# EasyEDA schematic RPi Shield - Schematic.json
TITLE: RPi Motor & Power Shield; REV: 1.0; Date: 2019-11-08; Sheet: 1/1; Drawn By: Liam Smolenaars; Company: McMaster IEEE
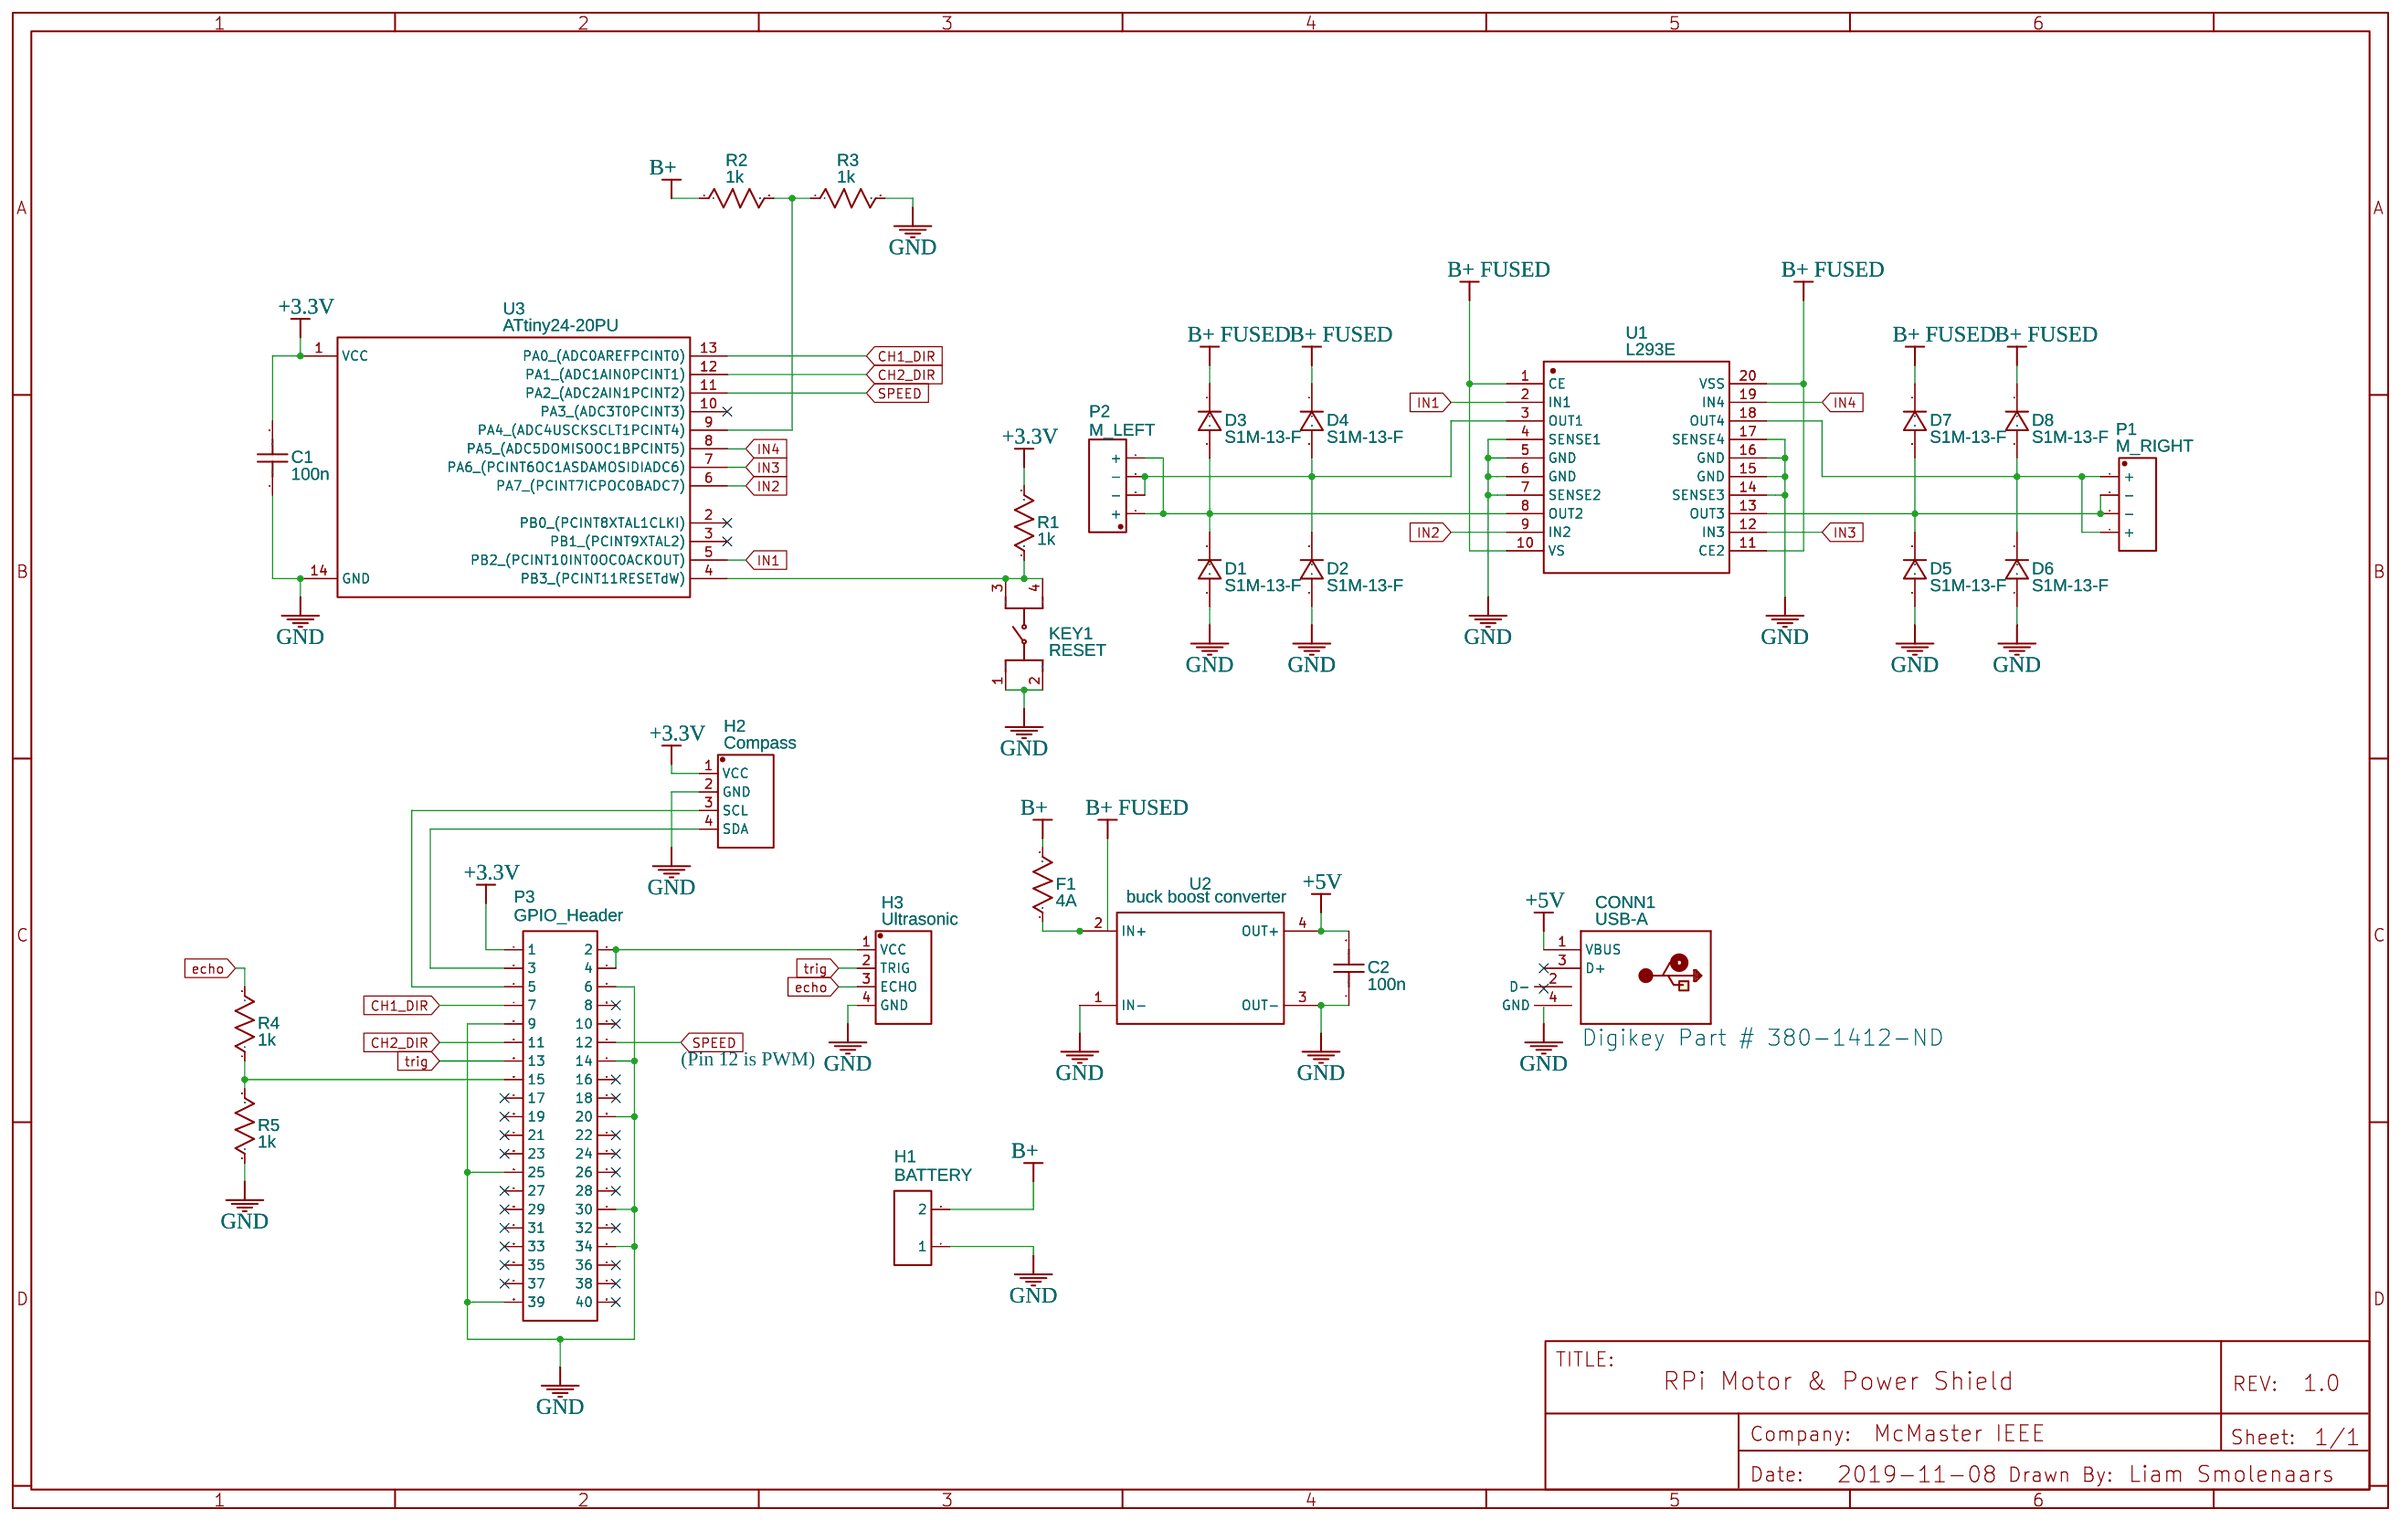
[diagram p0: schematic sheet]

## Parts
C1  100n  [1206]
C2  100n  [1206]
CONN1  USB-A  [USB_A-THT]
D1  S1M-13-F  [SMA_L4.3-W2.6-LS5.2-RD]
D2  S1M-13-F  [SMA_L4.3-W2.6-LS5.2-RD]
D3  S1M-13-F  [SMA_L4.3-W2.6-LS5.2-RD]
D4  S1M-13-F  [SMA_L4.3-W2.6-LS5.2-RD]
D5  S1M-13-F  [SMA_L4.3-W2.6-LS5.2-RD]
D6  S1M-13-F  [SMA_L4.3-W2.6-LS5.2-RD]
D7  S1M-13-F  [SMA_L4.3-W2.6-LS5.2-RD]
D8  S1M-13-F  [SMA_L4.3-W2.6-LS5.2-RD]
F1  4A  [1206]
H1  BATTERY  [HDR-2X1/2.54]
H2  Compass  [DIP-1X4P-2.54MM-M]
H3  Ultrasonic  [DIP-1X4P-2.54MM-M]
KEY1  RESET  [KEY-6.0*6.0-2]
P1  M_RIGHT  [WJ2EDGVC-5.08-4P]
P2  M_LEFT  [WJ2EDGVC-5.08-4P]
P3  GPIO_Header  [HDR-TH_40PIN-V-ROW2-COL20-FEMALE-PITCH2.54]
R1  1k  [1206]
R2  1k  [1206]
R3  1k  [1206]
R4  1k  [1206]
R5  1k  [1206]
U1  L293E  [DIP-20_LS7.62-L26.92-W7.11-PITCH2.54]
U2  buck boost converter  [BUCK BOOST BOARD]
U3  ATtiny24-20PU  [DIP14]

## Library data of the parts
C1 C2 = Cap_0805_US
CONN1 = -: sourceId: yOI0TbtL3; Mfg: TE Connectivity; Mfg Part: 292303-1; Cost: 1.12; Digikey: A31726-ND; Contributor: CowboyWillT
D1-D8 = -: Supplier: LCSC; Supplier Part: C155378; Manufacturer: Diodes Incorporated; Contributor: LCSC; LCSC Assembly: Yes; SMT Type: Extend
F1 R2-R5 = Res_1206(1/4W)_US
H1 = -: Supplier: LCSC; Manufacturer: TE Connectivity; Manufacturer Part: 826629-2; image: //image.lceda.cn/szlcsc/C86471.jpg; Supplier Part: C86471
H2 H3 = -: Supplier: LCSC; Manufacturer: Ckmtw; Manufacturer Part: 210S-1*4P L=11.6MMGold-plated black; Contributor: LCSC; Supplier Part: C124378
KEY1 = -: Supplier: LCSC; Manufacturer: SOFNG; Manufacturer Part: TS-1102-5016; Contributor: EasyEDA; Supplier Part: C111609
P1 P2 = -: Supplier: LCSC; Manufacturer: ReliaPro; image: //image.lceda.cn/szlcsc/C8436.jpg; Supplier Part: C8436
P3 = -: Supplier: LCSC; Manufacturer: BOOMELE; Manufacturer Part: 2.54mm 2*20PFemale header; image: //image.lceda.cn/szlcsc/C50982.jpg; Supplier Part: C50982
R1 = Res_AXIAL-0.4(1/4W)_US
U1 = -: Supplier: LCSC; Manufacturer: STMicroelectronics; image: //image.lceda.cn/szlcsc/C34150.jpg; Supplier Part: C34150
U2 = -: Contributor: liam.great98
U3 = -: 8-bit AVR Microcontroller, 20MHz, 2.7-5.5V, 2KB Flash, 128 Bytes EEPROM, 128 Bytes SRAM, 14-pin PDIP, Industrial Grade (-40u7648 to 85u7648), Pb-Free

## Nets
+3.3V: C1.2 H2.1(VCC) P3.1 R1.2 U3.1(VCC)
+5V: C2.2 CONN1.1(VBUS) U2.4(OUT+)
GND: C1.1 C2.1 CONN1.4(GND) D1.2 D2.2 D5.2 D6.2 H1.1 H2.2(GND) H3.4(GND) KEY1.1 KEY1.2 P3.6 P3.9 P3.14 P3.20 P3.25 P3.30 P3.34 P3.39 R3.2 R5.1 U1.4(SENSE1) U1.5(GND) U1.6(GND) U1.7(SENSE2) U1.14(SENSE3) U1.15(GND) U1.16(GND) U1.17(SENSE4) U2.1(IN-) U2.3(OUT-) U3.14(GND)
B+: F1.2 H1.2 R2.1
B+ FUSED: D3.1 D4.1 D7.1 D8.1 F1.1 U1.1(CE) U1.10(VS) U1.11(CE2) U1.20(VSS) U2.2(IN+)
CH1_DIR: P3.7 U3.13(PA0 (ADC0AREFPCINT0))
CH2_DIR: P3.11 U3.12(PA1 (ADC1AIN0PCINT1))
echo: H3.3(ECHO) R4.2
IN1: U1.2(IN1) U3.5(PB2 (PCINT10INT0OC0ACKOUT))
IN2: U1.9(IN2) U3.6(PA7 (PCINT7ICPOC0BADC7))
IN3: U1.12(IN3) U3.7(PA6 (PCINT6OC1ASDAMOSIDIADC6))
IN4: U1.19(IN4) U3.8(PA5 (ADC5DOMISOOC1BPCINT5))
SPEED: P3.12 U3.11(PA2 (ADC2AIN1PCINT2))
trig: H3.2(TRIG) P3.13
P3_2: H3.1(VCC) P3.2 P3.4
P3_3: H2.4(SDA) P3.3
P3_5: H2.3(SCL) P3.5
P3_15: P3.15 R4.1 R5.2
U1_3: D2.1 D4.2 P2.2(-) P2.3(-) U1.3(OUT1)
U1_8: D1.1 D3.2 P2.1(+) P2.4(+) U1.8(OUT2)
U1_13: D5.1 D7.2 P1.2(-) P1.3(-) U1.13(OUT3)
U1_18: D6.1 D8.2 P1.1(+) P1.4(+) U1.18(OUT4)
U3_4: KEY1.3 KEY1.4 R1.1 U3.4(PB3 (PCINT11RESETdW))
U3_9: R2.2 R3.1 U3.9(PA4 (ADC4USCKSCLT1PCINT4))

Not connected (* = marked no-connect by the designer): CONN1 2(D-)* 3(D+)*; P3 8* 10* 16* 17* 18* 19* 21* 22* 23* 24* 26* 27* 28* 29* 31* 32* 33* 35* 36* 37* 38* 40*; U3 2(PB0 (PCINT8XTAL1CLKI))* 3(PB1 (PCINT9XTAL2))* 10(PA3 (ADC3T0PCINT3))*

## Notes on the sheet
- Digikey Part # 380-1412-ND
- (Pin 12 is PWM)
